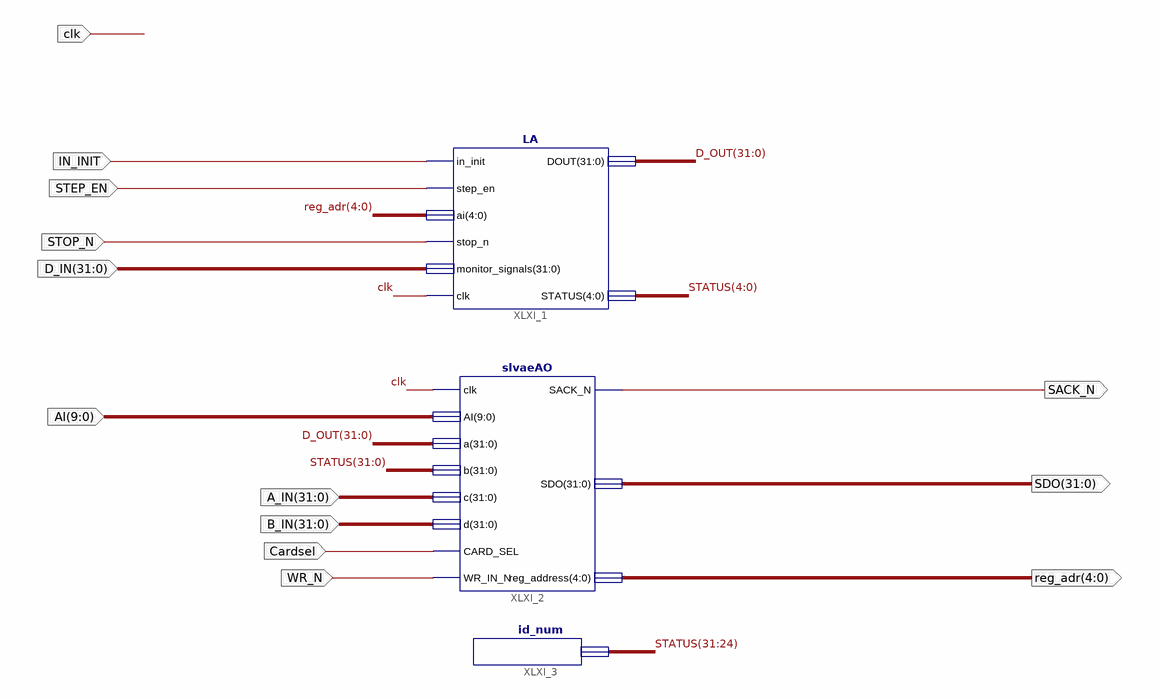
[diagram p0: schematic sheet 1]
// Xilinx ISE schematic monitor_slave.sch (spartan6) as structural Verilog: 3 symbols, 13 ports
module monitor_slave (
  input  IN_INIT,
  input  STEP_EN,
  input  STOP_N,
  input  [31:0] D_IN,
  input  clk,
  input  [31:0] A_IN,
  input  [31:0] B_IN,
  input  Cardsel,
  input  WR_N,
  input  [9:0] AI,
  output SACK_N,
  output [31:0] SDO,
  output [4:0] reg_adr
);

  wire [31:0] D_OUT, STATUS;

  slvaeAO XLXI_2 (
    .clk(clk), .AI(AI), .a(D_OUT), .b(STATUS), .c(A_IN), .d(B_IN), .CARD_SEL(Cardsel), .WR_IN_N(WR_N),
    .SACK_N(SACK_N), .SDO(SDO), .reg_address(reg_adr));
  LA XLXI_1 (
    .in_init(IN_INIT), .step_en(STEP_EN), .ai(reg_adr), .stop_n(STOP_N), .monitor_signals(D_IN), .clk(clk),
    .DOUT(D_OUT), .STATUS(STATUS[4:0]));
  id_num XLXI_3 (.ID(STATUS[31:24]));
endmodule
